# Altium schematic sheet Stepper-Driver-1.SchDoc: RespiraWorks
size A3; CompanyName: RespiraWorks; DrawnBy: K. Laws; Organization: Altium; DocumentNumber: 8; Revision: A1; SheetNumber: 8; SheetTotal: 8; PageSetup: Record=PageOptions|CenterHorizontal=True|CenterVertical=True|PrintScale=0.67|XCorrection=1.00|YCorrection=1.00|PrintKind=0|BorderSize=5000000|LeftOffset=0|BottomOffset=0|Orientation=2|PaperLength=1000|PaperWidth=1000|Scale=100|PaperSource=276|PrintQuality=-3|MediaType=1|DitherType=10|PrintScaleMode=1|PaperKind=11"x17" 279.4x431.8mm|PaperIndex=3; ProjectName: FALCON 3S
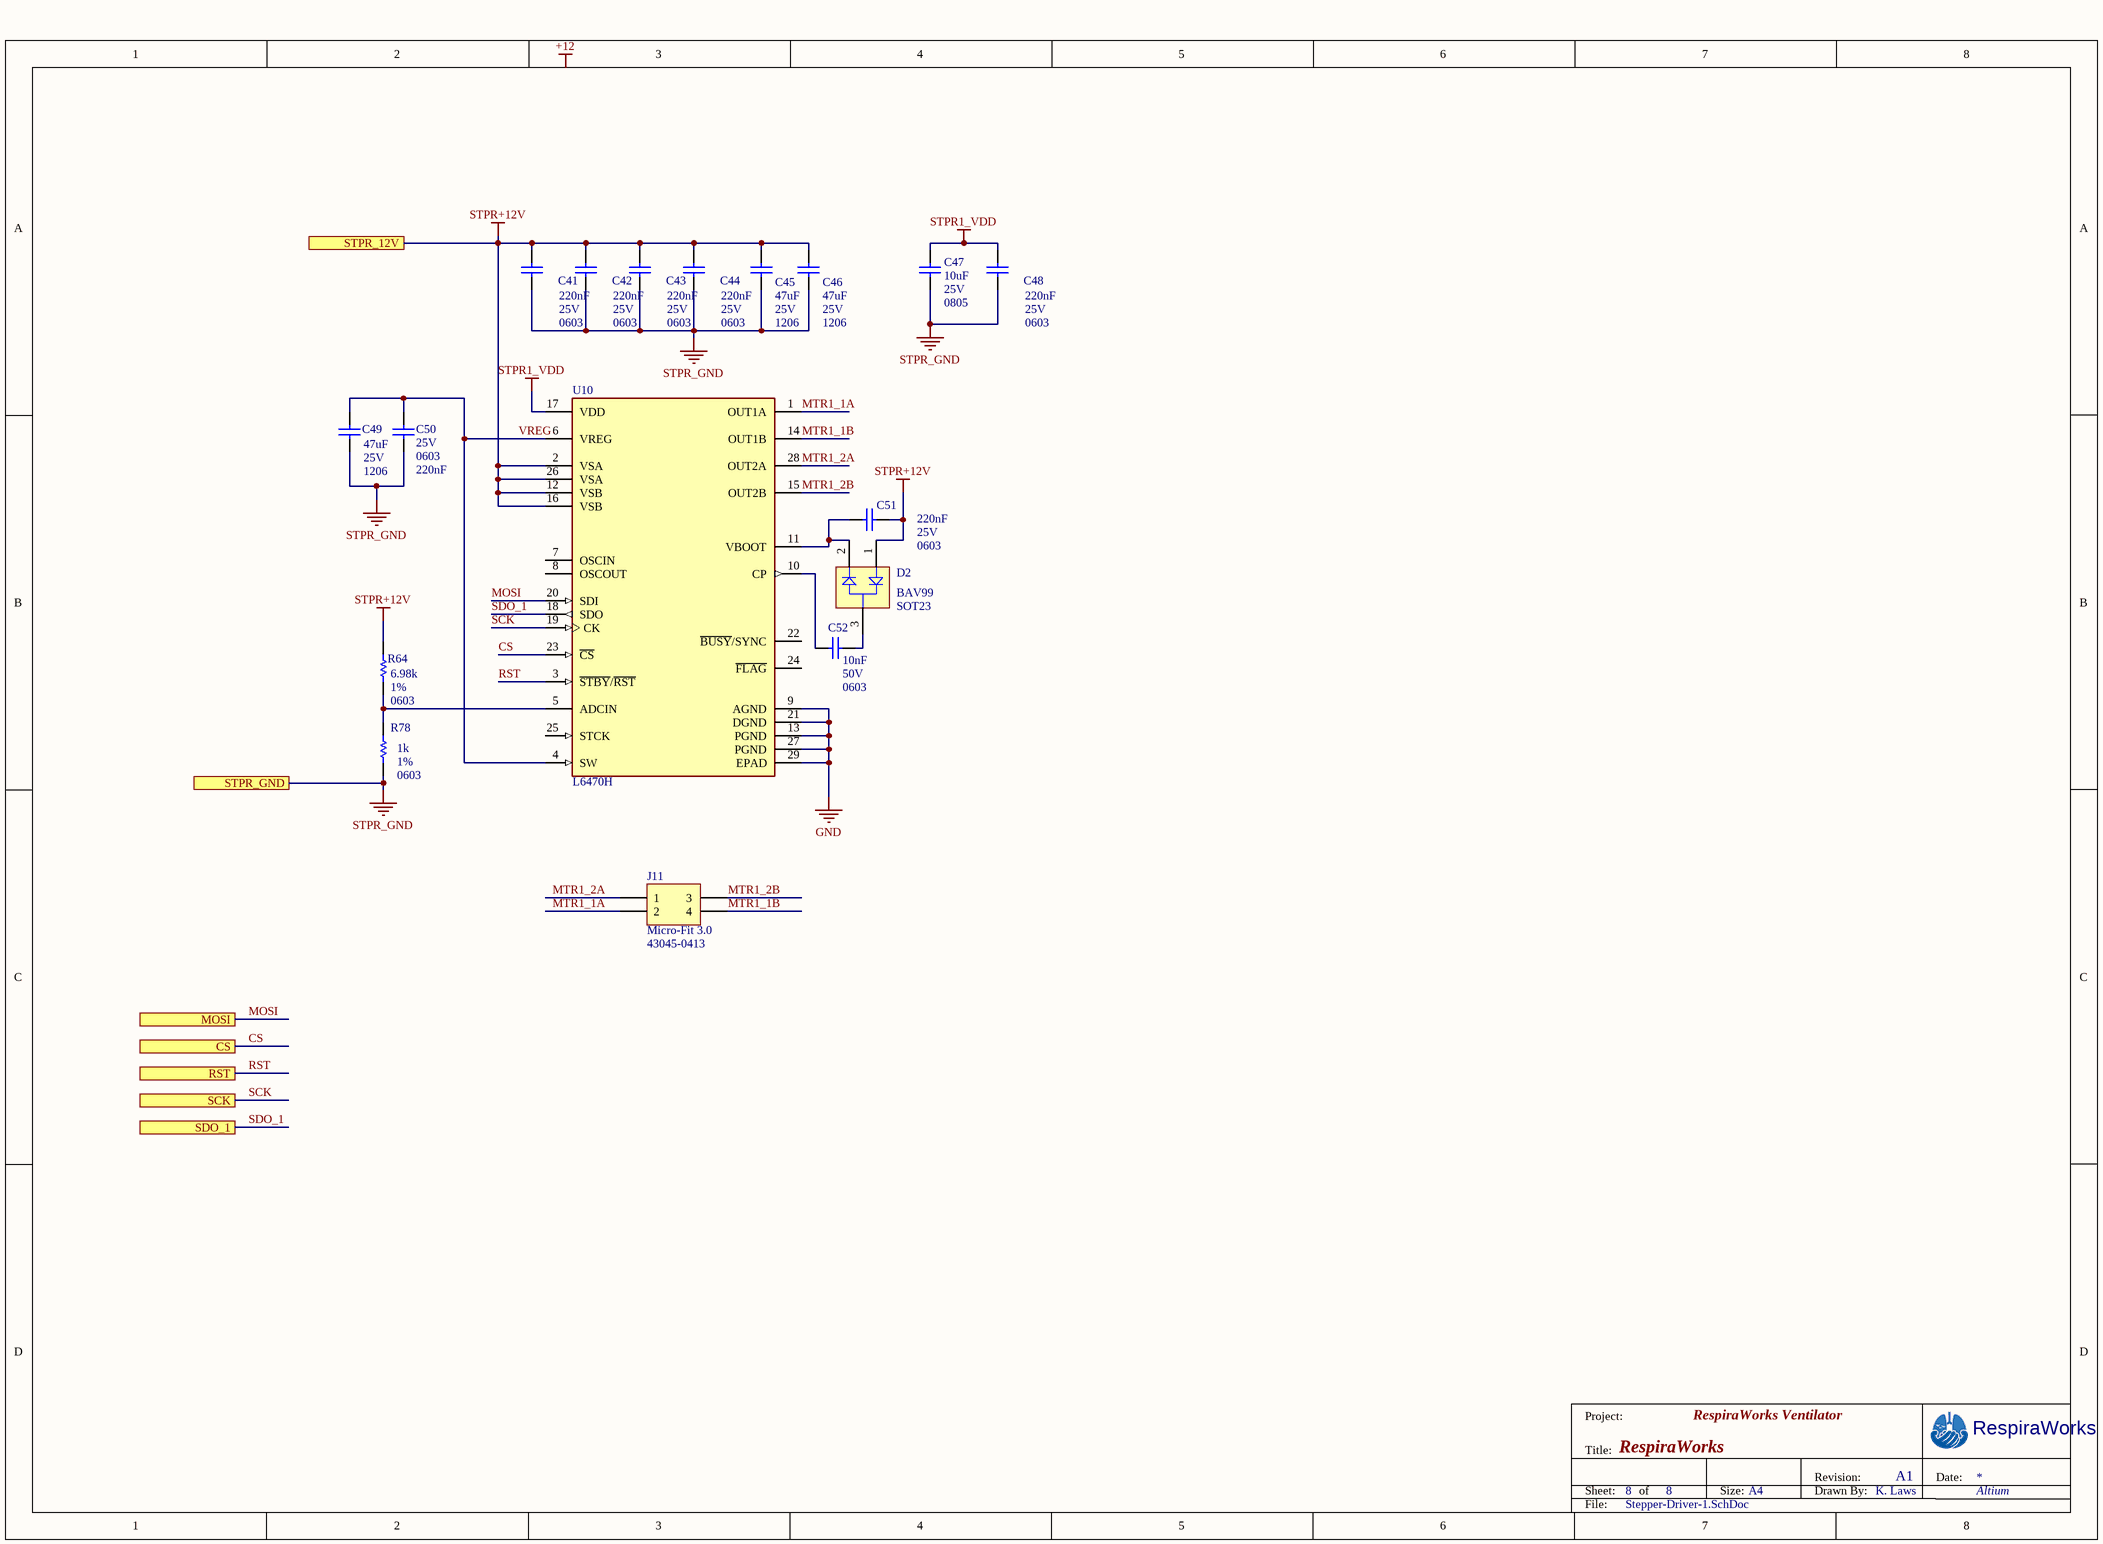
[diagram p0: Stepper-Driver-1.SchDoc]

## Parts
C41  Case/Package: 0603  Capacitance: 220nF  Voltage Rating: 25V  [CAPC0603(1608)100_L]  (hidden comment: Capacitor 220nF)
C42  Case/Package: 0603  Capacitance: 220nF  Voltage Rating: 25V  [CAPC0603(1608)100_L]  (hidden comment: Capacitor 220nF)
C43  Case/Package: 0603  Capacitance: 220nF  Voltage Rating: 25V  [CAPC0603(1608)100_L]  (hidden comment: Capacitor 220nF)
C44  Case/Package: 0603  Capacitance: 220nF  Voltage Rating: 25V  [CAPC0603(1608)100_L]  (hidden comment: Capacitor 220nF)
C45  Case/Package: 1206  Capacitance: 47uF  Voltage Rating: 25V  [FP-C3216-160-IPC_B]  (hidden comment: Capacitor 47uF)
C46  Case/Package: 1206  Capacitance: 47uF  Voltage Rating: 25V  [FP-C3216-160-IPC_B]  (hidden comment: Capacitor 47uF)
C47  Voltage Rating: 25V  Case/Package: 0805  Capacitance: 10uF  [CAPC2013X135X45LL10T25]  (hidden comment: Capacitor 10 uF)
C48  Case/Package: 0603  Capacitance: 220nF  Voltage Rating: 25V  [CAPC0603(1608)100_L]  (hidden comment: Capacitor 220nF)
C49  Case/Package: 1206  Capacitance: 47uF  Voltage Rating: 25V  [FP-C3216-160-IPC_B]  (hidden comment: Capacitor 47uF)
C50  Voltage Rating (DC): 25V  Case/Package: 0603  Capacitance: 220nF  [CAPC0603(1608)100_L]  (hidden comment: Capacitor 220nF)
C51  Voltage Rating (DC): 25V  Case/Package: 0603  Capacitance: 220nF  [CAPC0603(1608)100_L]  (hidden comment: Capacitor 220nF)
C52  Voltage Rating (DC): 50V  Capacitance: 10nF  Case/Package: 0603  [CAPC0603(1608)100_L]  (hidden comment: Capacitor 10nF)
D2  BAV99  PackageReference: SOT23  [INF-SOT23_L]
J11  Micro-Fit 3.0  [43045-0413]
R64  Tolerance: 1%  Case/Package: 0603  Resistance: 6.98k  [RESC1608X55X30NL15T15]  (hidden comment: Res 6.98k)
R78  Resistance: 1k  Tolerance: 1%  Case/Package: 0603  [RESC1608X55X30NL15T15]  (hidden comment: Res 1.0k 0603)
U10  L6470H  [FP-HTSSOP28-AM02392-IPC_B]

## Ports
CS, MOSI, RST, SCK, SDO_1, STPR_12V, STPR_GND

## Nets
GND: U10.9(AGND) U10.13(PGND) U10.21(DGND) U10.27(PGND) U10.29(EPAD)
STPR1_VDD: C47.2 C48.2 U10.17(VDD)
STPR+12V: C41.2 C42.2 C43.2 C44.2 C45.2 C46.2 C51.2 D2.1(A1) R64.2 U10.2(VSA) U10.12(VSB) U10.16(VSB) U10.26(VSA) ; port STPR_12V
STPR_GND: C41.1 C42.1 C43.1 C44.1 C45.1 C46.1 C47.1 C48.1 C49.1 C50.1 R78.1 ; port STPR_GND
CS: U10.23(~{CS}) ; port CS
MOSI: U10.20(SDI) ; port MOSI
MTR1_1A: J11.2 U10.1(OUT1A)
MTR1_1B: J11.4 U10.14(OUT1B)
MTR1_2A: J11.1 U10.28(OUT2A)
MTR1_2B: J11.3 U10.15(OUT2B)
RST: U10.3(~{STBY}/~{RST}) ; port RST
SCK: U10.19(CK) ; port SCK
SDO_1: U10.18(SDO) ; port SDO_1
VREG: C49.2 C50.2 U10.4(SW) U10.6(VREG)
NetC51_1: C51.1 D2.2(K2) U10.11(VBOOT)
NetC52_1: C52.1 U10.10(CP)
NetC52_2: C52.2 D2.3(C)
NetR64_1: R64.1 R78.2 U10.5(ADCIN)

Not connected (* = marked no-connect by the designer): U10 7(OSCIN) 8(OSCOUT) 22(~{BUSY}/SYNC) 24(~{FLAG}) 25(STCK)

## Notes on the sheet
- Project:
- RespiraWorks Ventilator
- Title:
- Sheet:
- of
- Size:
- A4
- Drawn By:
- Revision:
- Date:
- File:
- Labels drawn without touching a wire or pin: +12

## Library data of the parts
C41-C44 C48 = Capacitor 220nF: Capacitor 220 nF 25 VDC PU=4000 ST, GRM188R71E224KA88D, Murata; Tolerance: 10%; Dielectric: X7R; Voltage: 50V; Material: Ceramic; Supplier 1: Digi-Key; Manufacturer 1: Murata; Manufacturer Part Number 1: GRM188R71E224KA88D; Stock 1: 566672; Pricing 1: 1=0.23000, 10=0.15800, 100=0.08000, 500=0.05474, 1000=0.04842 (USD); RoHS: Yes; Mount: Surface Mount; Number of Pins: 2; Case Code (Metric): 1608; Case Code (Imperial): 0603; Min Operating Temperature: -55°C; Max Operating Temperature: 125°C; Packaging: Tape and Reel; Voltage Rating (DC): 25V; Package Quantity: 1; Termination: SMD/SMT; Length: 1.6mm; Height: 0.8mm; Width: 0.8mm; Thickness: 0.035inch; Depth: 0.8mm; Radiation Hardening: No; REACH SVHC: No SVHC; Lead Free: Lead Free; ComponentLink1URL: https://datasheet.ciiva.com/5411/product-5411362.pdf?src-supplier=Mouser; ComponentLink1Description: https://datasheet.ciiva.com/5411/product-5411362.pdf?src-supplier=Mouser; ComponentLink2URL: https://datasheet.ciiva.com/11786/0900766b807a1cab-11786308.pdf?src-supplier=RSComponents; ComponentLink2Description: https://datasheet.ciiva.com/11786/0900766b807a1cab-11786308.pdf?src-supplier=RSComponents; ComponentLink3URL: https://datasheet.ciiva.com/3777/1531grm188r71e224ka8823-3777688.pdf?src-supplier=Arrow; ComponentLink3Description: https://datasheet.ciiva.com/3777/1531grm188r71e224ka8823-3777688.pdf?src-supplier=Arrow; ComponentLink4URL: https://datasheet.ciiva.com/6068/1784408-6068393.pdf?src-supplier=Farnell; ComponentLink4Description: https://datasheet.ciiva.com/6068/1784408-6068393.pdf?src-supplier=Farnell; Supplier Part Number 1: 490-3290-1-ND; ComponentLink5URL: https://datasheet.ciiva.com/133/grm188r71e224ka88-01-133883.pdf?src-supplier=Digi-Key; ComponentLink5Description: https://datasheet.ciiva.com/133/grm188r71e224ka88-01-133883.pdf?src-supplier=Digi-Key; ComponentLink6URL: https://datasheet.ciiva.com/133/grm188r71e224ka88-01-133884.pdf?src-supplier=Digi-Key; ComponentLink6Description: https://datasheet.ciiva.com/133/grm188r71e224ka88-01-133884.pdf?src-supplier=Digi-Key; ComponentLink7URL: https://datasheet.ciiva.com/29202/451619-da-01-en-vs-kondensator-0603-29202002.pdf?src-supplier=Conrad; ComponentLink7Description: https://datasheet.ciiva.com/29202/451619-da-01-en-vs-kondensator-0603-29202002.pdf?src-supplier=Conrad; ComponentLink8URL: https://datasheet.ciiva.com/14116/nmgrm-data-en-14116629.pdf?src-supplier=Distrelec; ComponentLink8Description: https://datasheet.ciiva.com/14116/nmgrm-data-en-14116629.pdf?src-supplier=Distrelec; ComponentLink9URL: https://datasheet.ciiva.com/16425/product-16425866.pdf?src-supplier=Future+Electronics; ComponentLink9Description: https://datasheet.ciiva.com/16425/product-16425866.pdf?src-supplier=Future+Electronics; ComponentLink10URL: https://datasheet.ciiva.com/22703/1784408-22703338.pdf?src-supplier=Element14; ComponentLink10Description: https://datasheet.ciiva.com/22703/1784408-22703338.pdf?src-supplier=Element14; ComponentLink11URL: https://datasheet.ciiva.com/7937/1784408-7937645.pdf?src-supplier=Element14; ComponentLink11Description: https://datasheet.ciiva.com/7937/1784408-7937645.pdf?src-supplier=Element14; ComponentLink12URL: https://datasheet.ciiva.com/48436/nmgrm-data-en-48436687.pdf?src-supplier=Distrelec; ComponentLink12Description: https://datasheet.ciiva.com/48436/nmgrm-data-en-48436687.pdf?src-supplier=Distrelec
C45 C46 C49 = Capacitor 47uF: TDK - C3216X5R1E476M160AC - SMD Multilayer Ceramic Capacitor, 47 µF, 25 V, 1206 [3216 Metric], ± 20%, X5R, C Series; Supplier 1: Digi-Key; Manufacturer 1: TDK; Manufacturer Part Number 1: C3216X5R1E476M160AC; Stock 1: 497081; Pricing 1: 1=1.20000, 10=0.94900, 100=0.71160, 500=0.53762, 1000=0.47438 (USD); RoHS: Yes; Mount: Surface Mount; Weight: 0.000571oz; Case Code (Metric): 3216; Case Code (Imperial): 1206; Dielectric Material: Ceramic; Min Operating Temperature: -55°C; Max Operating Temperature: 85°C; Packaging: Tape and Reel; Package Quantity: 1; Tolerance: 20%; Voltage Rating (DC): 25V; Dielectric: X5R; Termination: SMD/SMT; Composition: Ceramic; Voltage: 25V; Length: 3.2mm; Height: 1.6mm; Width: 0.063inch; Depth: 1.6mm; Thickness: 1.6mm; REACH SVHC: No SVHC; Lead Free: Lead Free; ComponentLink1URL: https://datasheet.ciiva.com/6285/tdkmlcccaprange-6285269.pdf?src-supplier=Digi-Key; ComponentLink1Description: https://datasheet.ciiva.com/6285/tdkmlcccaprange-6285269.pdf?src-supplier=Digi-Key; ComponentLink2URL: https://datasheet.ciiva.com/6285/tdkmlcccaprange-6285271.pdf?src-supplier=Digi-Key; ComponentLink2Description: https://datasheet.ciiva.com/6285/tdkmlcccaprange-6285271.pdf?src-supplier=Digi-Key; ComponentLink3URL: https://datasheet.ciiva.com/6285/tdkmlcccaprange-6285273.pdf?src-supplier=Digi-Key; ComponentLink3Description: https://datasheet.ciiva.com/6285/tdkmlcccaprange-6285273.pdf?src-supplier=Digi-Key; ComponentLink4URL: https://datasheet.ciiva.com/16482/general-b11-16482556.pdf?src-supplier=Future+Electronics; ComponentLink4Description: https://datasheet.ciiva.com/16482/general-b11-16482556.pdf?src-supplier=Future+Electronics; Supplier Part Number 1: 445-8047-1-ND
C47 = Capacitor 10 uF: Generic capacitor 0805 pkg; Manufacturer 1: Murata; Manufacturer Part Number 1: GRM21BR61E106KA73L; Material: Ceramic; Tolerance: 10%; Dielectric: X5R; Supplier 1: Digi-Key; Stock 1: 11670000; Pricing 1: 3000=0.04180, 6000=0.03800, 9000=0.03610, 15000=0.03420 (USD); RoHS: Yes; Mount: Surface Mount; Case Code (Metric): 2012; Case Code (Imperial): 0805; Min Operating Temperature: -55°C; Max Operating Temperature: 85°C; Package Quantity: 1; Packaging: Tape and Reel; Voltage Rating (DC): 25V; Termination: SMD/SMT; Voltage: 25V; Length: 2mm; Height: 1.25mm; Width: 0.049inch; Thickness: 0.053inch; Depth: 1.25mm; Radiation Hardening: No; REACH SVHC: Unknown; Lead Free: Lead Free; ComponentLink1URL: https://datasheet.ciiva.com/28584/626718-28584288.pdf?src-supplier=Element14; ComponentLink1Description: https://datasheet.ciiva.com/28584/626718-28584288.pdf?src-supplier=Element14; ComponentLink2URL: https://datasheet.ciiva.com/16440/grm21br61e106ka73l-16440627.pdf?src-supplier=Future+Electronics; ComponentLink2Description: https://datasheet.ciiva.com/16440/grm21br61e106ka73l-16440627.pdf?src-supplier=Future+Electronics; ComponentLink3URL: https://datasheet.ciiva.com/5424/product-5424327.pdf?src-supplier=Mouser; ComponentLink3Description: https://datasheet.ciiva.com/5424/product-5424327.pdf?src-supplier=Mouser; ComponentLink4URL: https://datasheet.ciiva.com/22774/1747469-22774396.pdf?src-supplier=Farnell; ComponentLink4Description: https://datasheet.ciiva.com/22774/1747469-22774396.pdf?src-supplier=Farnell; ComponentLink5URL: https://datasheet.ciiva.com/139/partnumbering-e-01-139184.pdf?src-supplier=Digi-Key; ComponentLink5Description: https://datasheet.ciiva.com/139/partnumbering-e-01-139184.pdf?src-supplier=Digi-Key; ComponentLink6URL: https://datasheet.ciiva.com/7719/1747469-7719093.pdf?src-supplier=Element14; ComponentLink6Description: https://datasheet.ciiva.com/7719/1747469-7719093.pdf?src-supplier=Element14; ComponentLink7URL: https://datasheet.ciiva.com/28584/626718-28584279.pdf?src-supplier=Element14; ComponentLink7Description: https://datasheet.ciiva.com/28584/626718-28584279.pdf?src-supplier=Element14; ComponentLink8URL: https://datasheet.ciiva.com/14116/grmseries-highdielectrictype-eng-14116376.pdf?src-supplier=Distrelec; ComponentLink8Description: https://datasheet.ciiva.com/14116/grmseries-highdielectrictype-eng-14116376.pdf?src-supplier=Distrelec; Supplier Part Number 1: 490-5523-2-ND
C50 C51 = Capacitor 220nF: Capacitor 220 nF 25 VDC PU=4000 ST, GRM188R71E224KA88D, Murata; Material: Ceramic; Tolerance: 10%; Dielectric: X7R; Voltage: 50V; Supplier 1: Digi-Key; Manufacturer 1: Murata; Manufacturer Part Number 1: GRM188R71E224KA88D; Stock 1: 566672; Pricing 1: 1=0.23000, 10=0.15800, 100=0.08000, 500=0.05474, 1000=0.04842 (USD); RoHS: Yes; Mount: Surface Mount; Number of Pins: 2; Case Code (Imperial): 0603; Case Code (Metric): 1608; Min Operating Temperature: -55°C; Max Operating Temperature: 125°C; Voltage Rating: 25V; Packaging: Tape and Reel; Package Quantity: 1; Termination: SMD/SMT; Length: 1.6mm; Height: 0.8mm; Width: 0.8mm; Thickness: 0.035inch; Depth: 0.8mm; Radiation Hardening: No; REACH SVHC: No SVHC; Lead Free: Lead Free; ComponentLink1URL: https://datasheet.ciiva.com/5411/product-5411362.pdf?src-supplier=Mouser; ComponentLink1Description: https://datasheet.ciiva.com/5411/product-5411362.pdf?src-supplier=Mouser; ComponentLink2URL: https://datasheet.ciiva.com/11786/0900766b807a1cab-11786308.pdf?src-supplier=RSComponents; ComponentLink2Description: https://datasheet.ciiva.com/11786/0900766b807a1cab-11786308.pdf?src-supplier=RSComponents; ComponentLink3URL: https://datasheet.ciiva.com/3777/1531grm188r71e224ka8823-3777688.pdf?src-supplier=Arrow; ComponentLink3Description: https://datasheet.ciiva.com/3777/1531grm188r71e224ka8823-3777688.pdf?src-supplier=Arrow; ComponentLink4URL: https://datasheet.ciiva.com/6068/1784408-6068393.pdf?src-supplier=Farnell; ComponentLink4Description: https://datasheet.ciiva.com/6068/1784408-6068393.pdf?src-supplier=Farnell; ComponentLink5URL: https://datasheet.ciiva.com/133/grm188r71e224ka88-01-133883.pdf?src-supplier=Digi-Key; ComponentLink5Description: https://datasheet.ciiva.com/133/grm188r71e224ka88-01-133883.pdf?src-supplier=Digi-Key; ComponentLink6URL: https://datasheet.ciiva.com/133/grm188r71e224ka88-01-133884.pdf?src-supplier=Digi-Key; ComponentLink6Description: https://datasheet.ciiva.com/133/grm188r71e224ka88-01-133884.pdf?src-supplier=Digi-Key; ComponentLink7URL: https://datasheet.ciiva.com/29202/451619-da-01-en-vs-kondensator-0603-29202002.pdf?src-supplier=Conrad; ComponentLink7Description: https://datasheet.ciiva.com/29202/451619-da-01-en-vs-kondensator-0603-29202002.pdf?src-supplier=Conrad; ComponentLink8URL: https://datasheet.ciiva.com/14116/nmgrm-data-en-14116629.pdf?src-supplier=Distrelec; ComponentLink8Description: https://datasheet.ciiva.com/14116/nmgrm-data-en-14116629.pdf?src-supplier=Distrelec; ComponentLink9URL: https://datasheet.ciiva.com/16425/product-16425866.pdf?src-supplier=Future+Electronics; ComponentLink9Description: https://datasheet.ciiva.com/16425/product-16425866.pdf?src-supplier=Future+Electronics; ComponentLink10URL: https://datasheet.ciiva.com/22703/1784408-22703338.pdf?src-supplier=Element14; ComponentLink10Description: https://datasheet.ciiva.com/22703/1784408-22703338.pdf?src-supplier=Element14; ComponentLink11URL: https://datasheet.ciiva.com/7937/1784408-7937645.pdf?src-supplier=Element14; ComponentLink11Description: https://datasheet.ciiva.com/7937/1784408-7937645.pdf?src-supplier=Element14; ComponentLink12URL: https://datasheet.ciiva.com/48436/nmgrm-data-en-48436687.pdf?src-supplier=Distrelec; ComponentLink12Description: https://datasheet.ciiva.com/48436/nmgrm-data-en-48436687.pdf?src-supplier=Distrelec; Supplier Part Number 1: 490-3290-1-ND
C52 = Capacitor 10nF: Cap Ceramic 0.01uF 50V X7R 10% SMD 0603 125C Automotive T/R; Manufacturer 1: Yageo; Manufacturer Part Number 1: CC0603KRX7R9BB103; Insulation Resistance: 100GR; Supplier 1: Digi-Key; Stock 1: 921345; Pricing 1: 1=0.10000, 10=0.04100, 100=0.01810, 500=0.01294, 1000=0.01016 (USD); RoHS: Yes; Mount: Surface Mount; Number of Pins: 2; Case Code (Metric): 1608; Case Code (Imperial): 0603; Material: Ceramic; Min Operating Temperature: -55°C; Max Operating Temperature: 125°C; Tolerance: 10%; Packaging: Tape and Reel; Dielectric: X7R; Voltage Rating: 50V; Package Quantity: 1; Termination: SMD/SMT; Voltage: 50V; Composition: Ceramic; Length: 1.6mm; Height: 0.8mm; Width: 0.031inch; Depth: 0.8mm; Thickness: 0.035inch; Radiation Hardening: No; REACH SVHC: No SVHC; Lead Free: Lead Free; Halogen Free: Halogen Free; ComponentLink1URL: https://datasheet.ciiva.com/11788/0900766b8079c870-11788374.pdf?src-supplier=RSComponents; ComponentLink1Description: https://datasheet.ciiva.com/11788/0900766b8079c870-11788374.pdf?src-supplier=RSComponents; ComponentLink2URL: https://datasheet.ciiva.com/26862/getdatasheetpartid-403582-26862846.pdf?src-supplier=Verical; ComponentLink2Description: https://datasheet.ciiva.com/26862/getdatasheetpartid-403582-26862846.pdf?src-supplier=Verical; ComponentLink3URL: https://datasheet.ciiva.com/8033/1734573-8033861.pdf?src-supplier=Element14; ComponentLink3Description: https://datasheet.ciiva.com/8033/1734573-8033861.pdf?src-supplier=Element14; ComponentLink4URL: https://datasheet.ciiva.com/176/mlccorderingcode-176550.pdf?src-supplier=Digi-Key; ComponentLink4Description: https://datasheet.ciiva.com/176/mlccorderingcode-176550.pdf?src-supplier=Digi-Key; ComponentLink5URL: https://datasheet.ciiva.com/176/mlccorderingcode-176551.pdf?src-supplier=Digi-Key; ComponentLink5Description: https://datasheet.ciiva.com/176/mlccorderingcode-176551.pdf?src-supplier=Digi-Key; ComponentLink6URL: https://datasheet.ciiva.com/13389/upy-gphc-x7r-6-3v-to-50v-8-13389991.pdf?src-supplier=Mouser; ComponentLink6Description: https://datasheet.ciiva.com/13389/upy-gphc-x7r-6-3v-to-50v-8-13389991.pdf?src-supplier=Mouser; ComponentLink7URL: https://datasheet.ciiva.com/176/mlccorderingcode-176552.pdf?src-supplier=Digi-Key; ComponentLink7Description: https://datasheet.ciiva.com/176/mlccorderingcode-176552.pdf?src-supplier=Digi-Key; ComponentLink8URL: https://datasheet.ciiva.com/8033/1734573-8033816.pdf?src-supplier=Element14; ComponentLink8Description: https://datasheet.ciiva.com/8033/1734573-8033816.pdf?src-supplier=Element14; ComponentLink9URL: https://datasheet.ciiva.com/8033/70765-8033817.pdf?src-supplier=Element14; ComponentLink9Description: https://datasheet.ciiva.com/8033/70765-8033817.pdf?src-supplier=Element14; ComponentLink10URL: https://datasheet.ciiva.com/16625/upy-gphc-x7r-6-3v-to-50v-8-16625529.pdf?src-supplier=Avnet+Europe; ComponentLink10Description: https://datasheet.ciiva.com/16625/upy-gphc-x7r-6-3v-to-50v-8-16625529.pdf?src-supplier=Avnet+Europe; ComponentLink11URL: https://datasheet.ciiva.com/28450/1489800-28450619.pdf?src-supplier=Element14; ComponentLink11Description: https://datasheet.ciiva.com/28450/1489800-28450619.pdf?src-supplier=Element14; Supplier Part Number 1: 311-1085-1-ND
D2 = Silicon Switching Diode: Silicon Switching Diode, SOT23, Reel, Green; Manufacturer: Infineon; Green: TRUE; Mounting Technology: Surface Mount; ComponentLink3URL: http://www.infineon.com/dgdl/smbta14_mmbta14.pdf?folderId=db3a30431441fb5d011445c30f210183&fileId=db3a30431441fb5d011445ef0201018c; PartNumber: BAV99; ComponentLink2Description: Datasheet; ComponentLink2URL: http://www.infineon.com/dgdl/bav99series.pdf?folderId=db3a30431400ef6801141b5844e103ea&fileId=db3a30431400ef6801141c1b237d042f; PackageVersion: Apr-08; PackageDescription: 3-Pin Small Outline Transistor Package, 1.3 x 2.9 mm Body, 0.95 mm Pitch; RevisionNote: Re-Activated Devices; ComponentLink1URL: http://www.infineon.com/; ComponentLink1Description: Manufacturer URL; ComponentLink3Description: Package Specification; Packing: Reel
J11 = 43045-0413: Conn, Micro-Fit 3.0, PCB Male Pin, 2x2pos, Thru-hole; Manufacturer: Molex; Manufacturer P/N: 43045-0413
R64 = Res 6.98k: ICK FILM, RESISTOR, 6.98KOHM, 100mW, ±1%, FULL REEL; Product Range:PANASONIC - ERJ Series Thick Film Chip Resistors; Resistance:6.98kohm; Power Rating:100mW; Resistance Tolerance:± 1%; Resistor Case Style:0603 ^1608 Metric]; Manufacturer Part Number 1: ERJ-3EKF6981V; Voltage Rating: 75V; Temperature Coefficient: 100ppm/°C; Voltage Rating (DC): 50V; Supplier 1: Digi-Key; Manufacturer 1: Panasonic; Stock 1: 205180; Pricing 1: 1=0.10000, 10=0.05600, 100=0.02300, 1000=0.01031, 2500=0.00895 (USD); RoHS: Yes; Mount: Surface Mount; Case Code (Metric): 1608; Case Code (Imperial): 0603; Contact Plating: Tin; Min Operating Temperature: -55°C; Max Operating Temperature: 155°C; Power Rating: 100mW; Packaging: Tape and Reel; Package Quantity: 1; Composition: Thick Film; Number of Terminations: 2; Military Standard: Not; Termination: SMD/SMT; Max Power Dissipation: 100mW; Features: Automotive AEC-Q200; Length: 1.6mm; Height: 0.022inch; Width: 0.031inch; Depth: 0.8mm; REACH SVHC: No SVHC; Lead Free: Lead Free; ComponentLink1URL: https://datasheet.ciiva.com/30264/aoa0000ce2-30264149.pdf?src-supplier=Onlinecomponents.com; ComponentLink1Description: https://datasheet.ciiva.com/30264/aoa0000ce2-30264149.pdf?src-supplier=Onlinecomponents.com; ComponentLink2URL: https://datasheet.ciiva.com/24026/aoa0000ce2-24026728.pdf?src-supplier=Mouser; ComponentLink2Description: https://datasheet.ciiva.com/24026/aoa0000ce2-24026728.pdf?src-supplier=Mouser; ComponentLink3URL: https://datasheet.ciiva.com/16759/70260748-16759567.pdf?src-supplier=Allied+Electronics; ComponentLink3Description: https://datasheet.ciiva.com/16759/70260748-16759567.pdf?src-supplier=Allied+Electronics; ComponentLink4URL: https://datasheet.ciiva.com/46388/426256-46388933.pdf?src-supplier=Element14; ComponentLink4Description: https://datasheet.ciiva.com/46388/426256-46388933.pdf?src-supplier=Element14; ComponentLink5URL: https://datasheet.ciiva.com/43519/426256-43519526.pdf?src-supplier=Farnell; ComponentLink5Description: https://datasheet.ciiva.com/43519/426256-43519526.pdf?src-supplier=Farnell; ComponentLink6URL: https://datasheet.ciiva.com/9194/aoa0000ce2-9194871.pdf?src-supplier=Avnet; ComponentLink6Description: https://datasheet.ciiva.com/9194/aoa0000ce2-9194871.pdf?src-supplier=Avnet; ComponentLink7URL: https://datasheet.ciiva.com/28658/1678782-28658396.pdf?src-supplier=Element14; ComponentLink7Description: https://datasheet.ciiva.com/28658/1678782-28658396.pdf?src-supplier=Element14; ComponentLink8URL: https://datasheet.ciiva.com/28531/1678782-28531613.pdf?src-supplier=Element14; ComponentLink8Description: https://datasheet.ciiva.com/28531/1678782-28531613.pdf?src-supplier=Element14; ComponentLink9URL: https://datasheet.ciiva.com/16775/70260748-16775262.pdf?src-supplier=Allied+Electronics; ComponentLink9Description: https://datasheet.ciiva.com/16775/70260748-16775262.pdf?src-supplier=Allied+Electronics; Supplier Part Number 1: P6.98KHCT-ND
R78 = Res 1.0k 0603: Res Thick Film 0603 1K Ohm 1% 1/10W ±100ppm/°C Molded SMD Punched Carrier T/R; Manufacturer 1: Panasonic; Manufacturer Part Number 1: ERJ3EKF1001V; Power Rating: 100mW; Voltage Rating: 75V; Supplier 1: Digi-Key; Stock 1: 1538640; Pricing 1: 1=0.10000, 10=0.03900, 100=0.01590, 1000=0.00716, 2500=0.00621 (USD); RoHS: Yes; Mount: Surface Mount; Number of Pins: 2; Case Code (Metric): 1608; Case Code (Imperial): 0603; Contact Plating: Tin; Min Operating Temperature: -55°C; Max Operating Temperature: 155°C; Packaging: Tape and Reel; Package Quantity: 5000; Composition: Thick Film; Number of Terminations: 2; Termination: SMD/SMT; Military Standard: Not; Temperature Coefficient: 100ppm/°C; Max Power Dissipation: 100mW; Voltage Rating (DC): 75V; Features: Automotive AEC-Q200; Length: 1.6mm; Height: 0.45mm; Width: 0.8mm; Depth: 0.8mm; Radiation Hardening: No; REACH SVHC: No SVHC; Lead Free: Lead Free; ComponentLink1URL: https://datasheet.ciiva.com/16768/70260748-16768437.pdf?src-supplier=Allied+Electronics; ComponentLink1Description: https://datasheet.ciiva.com/16768/70260748-16768437.pdf?src-supplier=Allied+Electronics; ComponentLink2URL: https://datasheet.ciiva.com/16774/70260748-16774550.pdf?src-supplier=Allied+Electronics; ComponentLink2Description: https://datasheet.ciiva.com/16774/70260748-16774550.pdf?src-supplier=Allied+Electronics; ComponentLink3URL: https://datasheet.ciiva.com/16449/aoa0000ce2-16449065.pdf?src-supplier=Future+Electronics; ComponentLink3Description: https://datasheet.ciiva.com/16449/aoa0000ce2-16449065.pdf?src-supplier=Future+Electronics; ComponentLink4URL: https://datasheet.ciiva.com/7942/aoa0000ce2-7942427.pdf?src-supplier=Element14; ComponentLink4Description: https://datasheet.ciiva.com/7942/aoa0000ce2-7942427.pdf?src-supplier=Element14; ComponentLink5URL: https://datasheet.ciiva.com/9198/aoa0000ce2-9198923.pdf?src-supplier=Avnet; ComponentLink5Description: https://datasheet.ciiva.com/9198/aoa0000ce2-9198923.pdf?src-supplier=Avnet; ComponentLink6URL: https://datasheet.ciiva.com/46373/1678782-46373339.pdf?src-supplier=Element14; ComponentLink6Description: https://datasheet.ciiva.com/46373/1678782-46373339.pdf?src-supplier=Element14; ComponentLink7URL: https://datasheet.ciiva.com/48530/aoa0000ce2-48530987.pdf?src-supplier=Avnet; ComponentLink7Description: https://datasheet.ciiva.com/48530/aoa0000ce2-48530987.pdf?src-supplier=Avnet; ComponentLink8URL: https://datasheet.ciiva.com/46373/1678782-46373340.pdf?src-supplier=Element14; ComponentLink8Description: https://datasheet.ciiva.com/46373/1678782-46373340.pdf?src-supplier=Element14; ComponentLink9URL: https://datasheet.ciiva.com/24070/aoa0000ce2-24070269.pdf?src-supplier=Mouser; ComponentLink9Description: https://datasheet.ciiva.com/24070/aoa0000ce2-24070269.pdf?src-supplier=Mouser; ComponentLink10URL: https://datasheet.ciiva.com/22673/1678782-22673918.pdf?src-supplier=Element14; ComponentLink10Description: https://datasheet.ciiva.com/22673/1678782-22673918.pdf?src-supplier=Element14; ComponentLink11URL: https://datasheet.ciiva.com/17215/aoa0000ce2-17215311.pdf?src-supplier=Avnet+Europe; ComponentLink11Description: https://datasheet.ciiva.com/17215/aoa0000ce2-17215311.pdf?src-supplier=Avnet+Europe; ComponentLink12URL: https://datasheet.ciiva.com/30063/aoa0000ce2-30063390.pdf?src-supplier=Onlinecomponents.com; ComponentLink12Description: https://datasheet.ciiva.com/30063/aoa0000ce2-30063390.pdf?src-supplier=Onlinecomponents.com; Supplier Part Number 1: P1.00KHDKR-ND
U10 = L6470H: Microstepping Motor Driver 3.3V 28-Pin HTSSOP Tube; Manufacturer 1: STMicroelectronics; Output Current: 3A; Interface: SPI; Max Supply Voltage: 5V; Min Supply Voltage: 8V; Number of Outputs: 1; Motor Type: Stepper; Operating Supply Current: 500uA; Logic Function: AND; Collector Emitter Voltage (VCEO): 45V; Switching Frequency: 125kHz; Supplier 1: Digi-Key; Manufacturer Part Number 1: L6470H; Stock 1: 2509; Pricing 1: 1=7.72000, 10=6.97200, 25=6.64800, 100=5.51310, 250=5.02664, 500=4.70236, 1000=4.21590, 2500=4.05375, 5000=3.98889 (USD); RoHS: Yes; Mount: Surface Mount; Case/Package: TSSOP; Number of Pins: 28; Weight: 0.004233oz; Min Operating Temperature: -25°C; Max Operating Temperature: 150°C; Packaging: Rail/Tube; Package Quantity: 50; Max Output Current: 3A; Max Collector Current: 3A; Output Voltage: 45V; Length: 9.8mm; Height: 1.05mm; Width: 4.5mm; Radiation Hardening: No; Lead Free: Lead Free; REACH SVHC: No SVHC; ComponentLink1URL: https://datasheet.ciiva.com/15109/getdatasheetpartid-507037-15109572.pdf?src-supplier=Verical; ComponentLink1Description: https://datasheet.ciiva.com/15109/getdatasheetpartid-507037-15109572.pdf?src-supplier=Verical; Supplier Part Number 1: 497-14775-5-ND